# EAGLE schematic CAN_splitter (EAGLE 9.0.1)
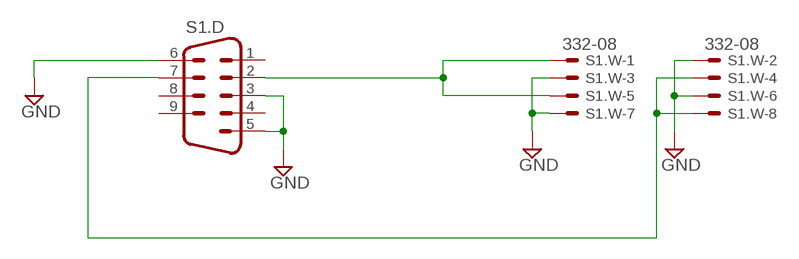
[diagram p0: schematic, sheet 1]

## Parts
S1.D  M09V  [M09V]
S1.W  332-08  [332-08]

## Nets
GND: S1.D.3 S1.D.5 S1.D.6 S1.W.2 S1.W.3 S1.W.6 S1.W.7
N$1: S1.D.2 S1.W.1 S1.W.5
N$5: S1.D.7 S1.W.4 S1.W.8
Unconnected: S1.D.1 S1.D.4 S1.D.8 S1.D.9

## Library data of the parts
S1.D = con-subd:M09: SUB-D; OC_FARNELL: unknown; OC_NEWARK: unknown
S1.W = con-garry:332-08: 8 Pin - 2mm Dual Row Source: www.mpe-connector.de / garry_shortform_2012.pdf